# Altium schematic sheet STRWL-S01-V00-Master.SchDoc: STRWL Master
size A3; DrawnBy: Jarrod Fisher; Organization: QUT Motorsport; Address1: O-120, Gardens Point; Address2: 2 George Street; Address3: Brisbane, QLD 4000; Address4: Australia; DocumentNumber: ####; Revision: 00; SheetNumber: 1; SheetTotal: 6; Version: 00; Project: STRWL QEV3; PageSetup: Record=PageOptions|CenterHorizontal=True|CenterVertical=True|PrintScale=0.97|XCorrection=1.00|YCorrection=1.00|PrintKind=0|BorderSize=5000000|LeftOffset=0|BottomOffset=0|Orientation=2|PaperLength=1000|PaperWidth=1000|Scale=100|PaperSource=7|PrintQuality=-4|MediaType=1|DitherType=10|PaperKind=A4|PrintScaleMode=1
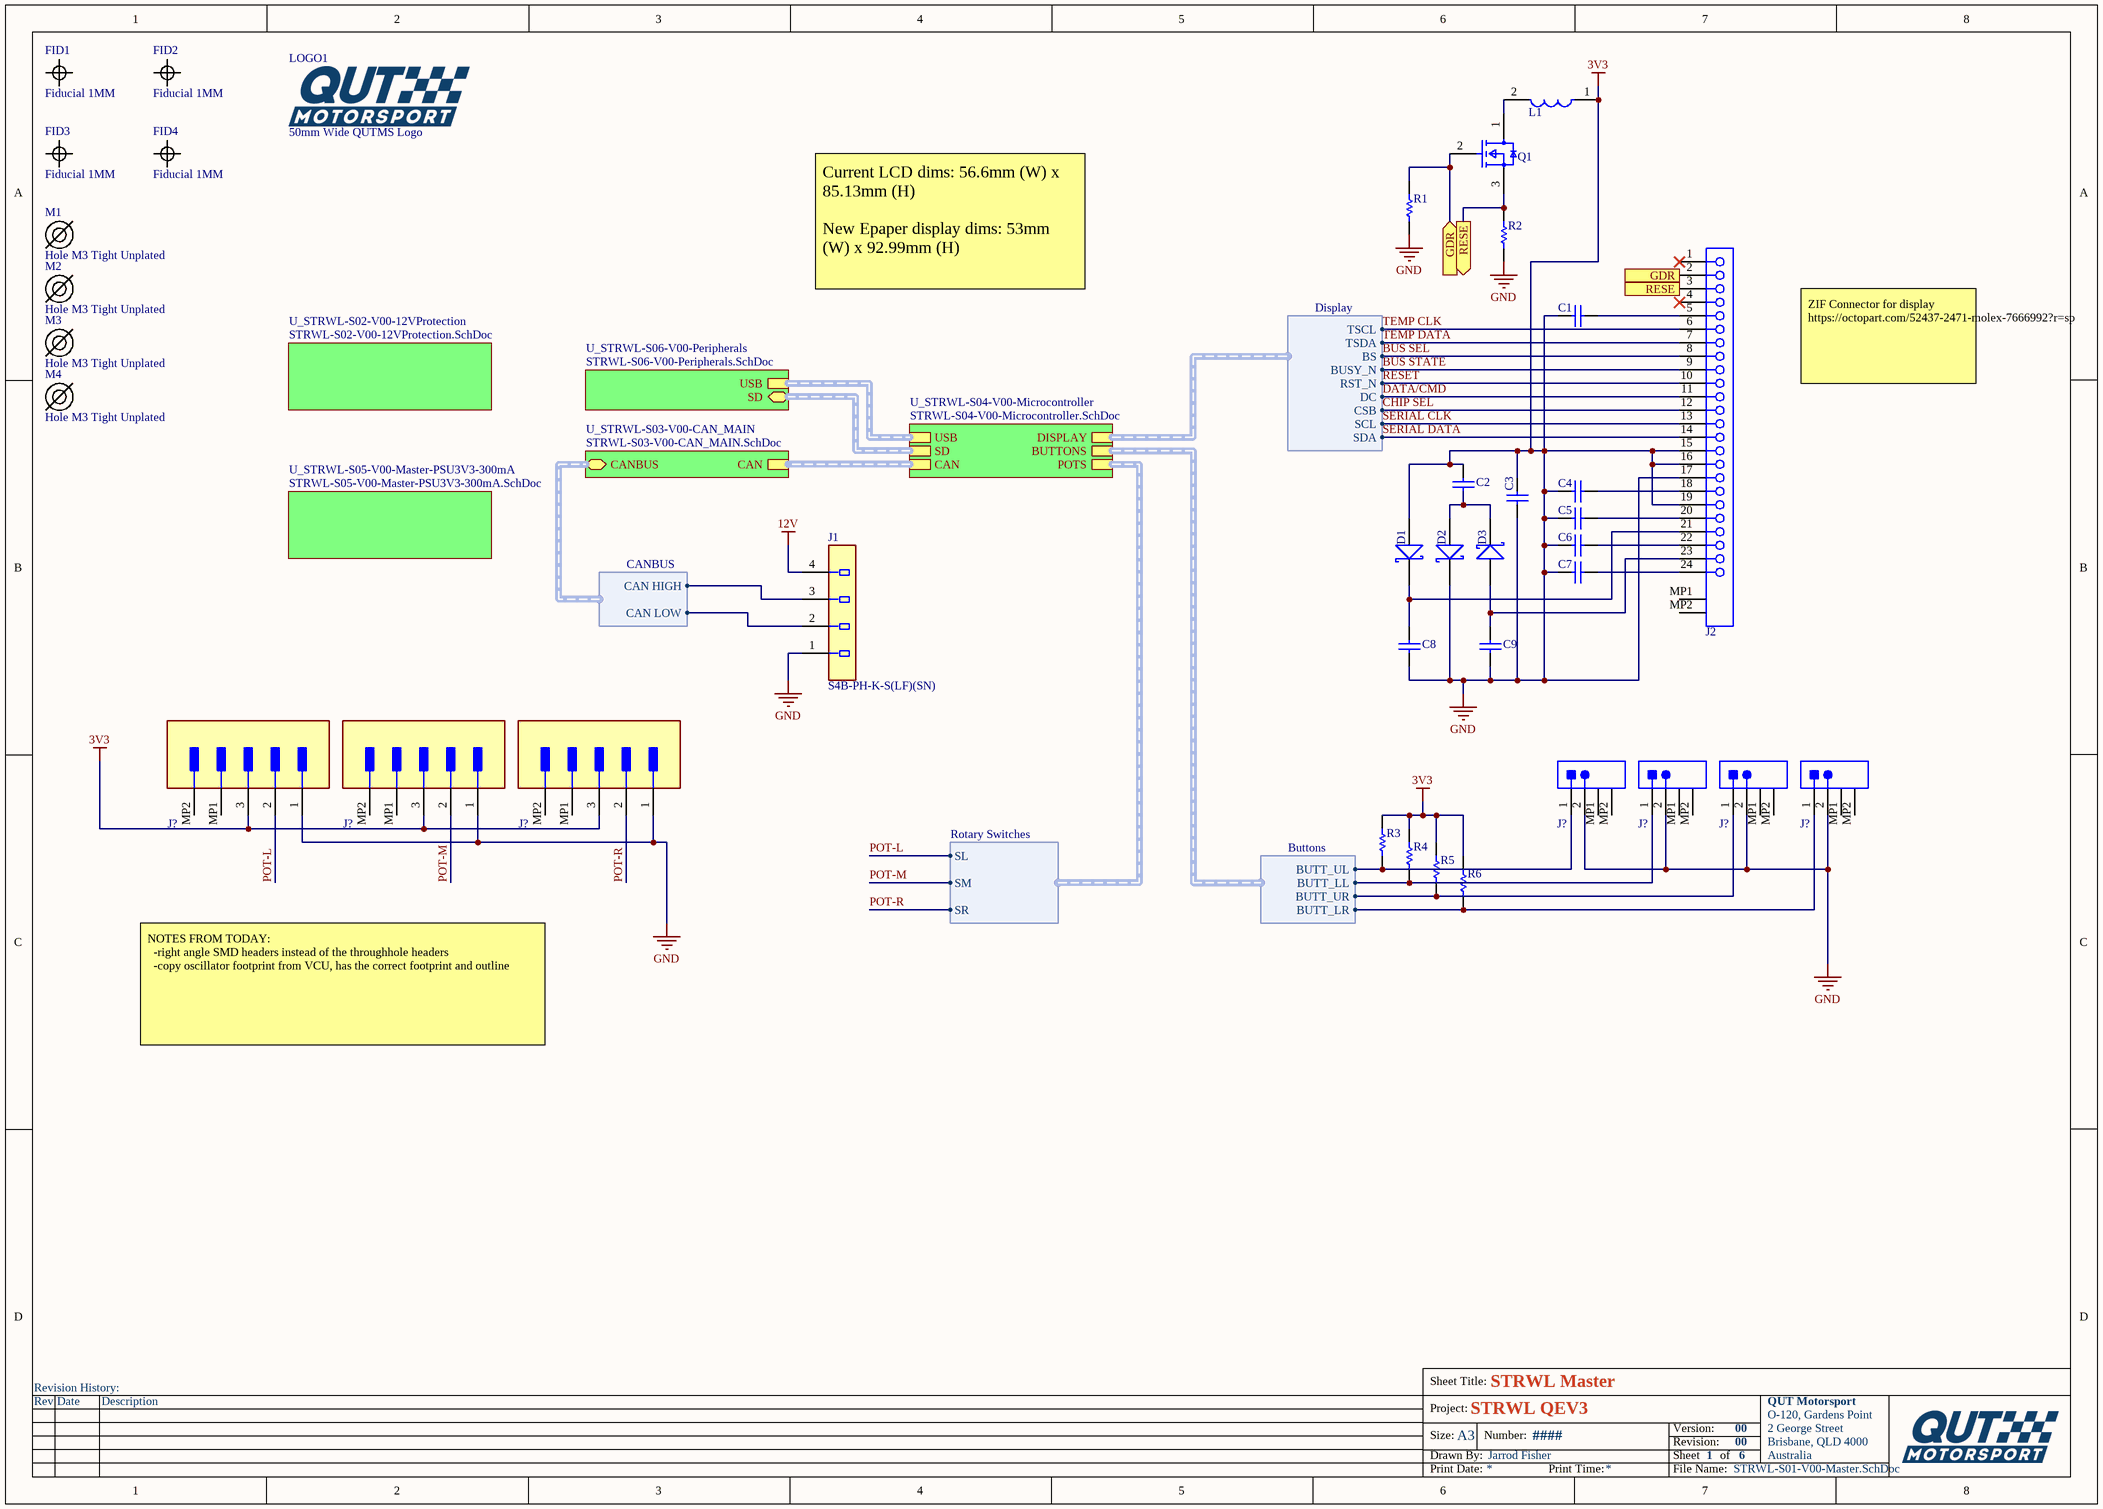
[diagram p0: STRWL-S01-V00-Master.SchDoc]

## Parts
(Parts that share a designator on the sheet are numbered #1, #2 ... from top to bottom, then left to right.)
C1  1uF 25V 5% X7R 0603  [Cap_Ceramic_0603]  (value not drawn)
C2  4u7 50V 5% X7R 0603  [Cap_Ceramic_0603]  (value not drawn)
C3  1uF 25V 5% X7R 0603  [Cap_Ceramic_0603]  (value not drawn)
C4  1uF 25V 5% X7R 0603  [Cap_Ceramic_0603]  (value not drawn)
C5  1uF 25V 5% X7R 0603  [Cap_Ceramic_0603]  (value not drawn)
C6  1uF 25V 5% X7R 0603  [Cap_Ceramic_0603]  (value not drawn)
C7  1uF 25V 5% X7R 0603  [Cap_Ceramic_0603]  (value not drawn)
C8  1uF 25V 5% X7R 0603  [Cap_Ceramic_0603]  (value not drawn)
C9  1uF 25V 5% X7R 0603  [Cap_Ceramic_0603]  (value not drawn)
D1  STPS0530Z  [SOD123]  (value not drawn)
D2  STPS0530Z  [SOD123]  (value not drawn)
D3  STPS0530Z  [SOD123]  (value not drawn)
FID1  Fiducial 1MM  [FIDUCIAL 1MM]  (no BOM)
FID2  Fiducial 1MM  [FIDUCIAL 1MM]  (no BOM)
FID3  Fiducial 1MM  [FIDUCIAL 1MM]  (no BOM)
FID4  Fiducial 1MM  [FIDUCIAL 1MM]  (no BOM)
J1  Part Number: S4B-PH-K-S(LF)(SN)  [JST_S4B-PH-K-S_LF_SN_0]  (hidden comment: JST PH 4 Way Through Hole Header)
J2  52437-2471  [MOLX-52437-2471]  (value not drawn)
J?#1  JST PH 3 Way SMD Header  (value not drawn)
J?#2  JST PH 3 Way SMD Header  (value not drawn)
J?#3  JST PH 3 Way SMD Header  (value not drawn)
J?#4  JST PH 2 Way SMD Header  [JST- S2B-PH-SM4-TB(LF)(SN)-2_V]  (value not drawn)
J?#5  JST PH 2 Way SMD Header  [JST- S2B-PH-SM4-TB(LF)(SN)-2_V]  (value not drawn)
J?#6  JST PH 2 Way SMD Header  [JST- S2B-PH-SM4-TB(LF)(SN)-2_V]  (value not drawn)
J?#7  JST PH 2 Way SMD Header  [JST- S2B-PH-SM4-TB(LF)(SN)-2_V]  (value not drawn)
L1  LQM21FN100M70L  [Murata_LQM21FN_70_MFG]  (value not drawn)
LOGO1  50mm Wide QUTMS Logo  [QUTMS LOGO 10MM]  (no BOM)
M1  Hole M3 Tight Unplated  [M3.2 UNPLATED]
M2  Hole M3 Tight Unplated  [M3.2 UNPLATED]
M3  Hole M3 Tight Unplated  [M3.2 UNPLATED]
M4  Hole M3 Tight Unplated  [M3.2 UNPLATED]
Q1  MOSFET N-CH 30V 4A SOT323  [Diodes_SOT323_0]  (value not drawn)
R1  10k 1% 0603  [Res_ThinFilm_0603]  (value not drawn)
R2  0R47 5% 0603  [Res_ThinFilm_0603]  (value not drawn)
R3  10k 5% 0603  [Res_ThinFilm_0603]  (value not drawn)
R4  10k 5% 0603  [Res_ThinFilm_0603]  (value not drawn)
R5  10k 5% 0603  [Res_ThinFilm_0603]  (value not drawn)
R6  10k 5% 0603  [Res_ThinFilm_0603]  (value not drawn)

## Sub-sheets
U_STRWL-S02-V00-12VProtection = STRWL-S02-V00-12VProtection.SchDoc: no entries
U_STRWL-S03-V00-CAN_MAIN = STRWL-S03-V00-CAN_MAIN.SchDoc: CANBUS (bidir, harness CANBUS), CAN (harness CAN)
U_STRWL-S04-V00-Microcontroller = STRWL-S04-V00-Microcontroller.SchDoc: USB (harness USB), SD (harness SD), CAN (harness CAN), DISPLAY (harness Display), BUTTONS (harness Buttons), POTS (harness Rotary Switches)
U_STRWL-S05-V00-Master-PSU3V3-300mA = STRWL-S05-V00-Master-PSU3V3-300mA.SchDoc: no entries
U_STRWL-S06-V00-Peripherals = STRWL-S06-V00-Peripherals.SchDoc: USB (harness USB), SD (bidir, harness SD)

## Ports
GDR (in), GDR (out), RESE (in), RESE (out)

## Harnesses
CANBUS: CAN HIGH, CAN LOW
Display: CSB, SCL, SDA, TSCL, TSDA, BS, BUSY_N, RST_N, DC
Buttons: BUTT_UL, BUTT_LL, BUTT_UR, BUTT_LR
Rotary Switches: SL, SM, SR

## Nets
3V3: C1.1 C2.2 C3.1 C3.2 C4.1 C5.1 C6.1 C7.1 C8.1 C9.1 D1.A D2.K J1.1 J2.15 J2.16 J2.17 J2.19 J?#1.1 J?#1.3 J?#2.1 J?#2.3 J?#3.1 J?#3.3 J?#4.2 J?#5.2 J?#6.2 J?#7.2 L1.1 R1.2 R2.1 R3.1 R4.1 R5.2 R6.2  [also labelled GND]
12V: J1.4
BUS SEL: J2.8 ; sheet U_STRWL-S04-V00-Microcontroller/DISPLAY.BS
BUS STATE: J2.9 ; sheet U_STRWL-S04-V00-Microcontroller/DISPLAY.BUSY_N
CHIP SEL: J2.12 ; sheet U_STRWL-S04-V00-Microcontroller/DISPLAY.CSB
DATA/CMD: J2.11 ; sheet U_STRWL-S04-V00-Microcontroller/DISPLAY.DC
GDR: J2.2 Q1.2(G) R1.1 ; port GDR
POT-L: J?#1.2 ; sheet U_STRWL-S04-V00-Microcontroller/POTS.SL
POT-M: J?#2.2 ; sheet U_STRWL-S04-V00-Microcontroller/POTS.SM
POT-R: J?#3.2 ; sheet U_STRWL-S04-V00-Microcontroller/POTS.SR
RESE: J2.3 Q1.3(S) R2.2 ; port RESE
RESET: J2.10 ; sheet U_STRWL-S04-V00-Microcontroller/DISPLAY.RST_N
SERIAL CLK: J2.13 ; sheet U_STRWL-S04-V00-Microcontroller/DISPLAY.SCL
SERIAL DATA: J2.14 ; sheet U_STRWL-S04-V00-Microcontroller/DISPLAY.SDA
TEMP CLK: J2.6 ; sheet U_STRWL-S04-V00-Microcontroller/DISPLAY.TSCL
TEMP DATA: J2.7 ; sheet U_STRWL-S04-V00-Microcontroller/DISPLAY.TSDA
NetC1_2: C1.2 J2.5
NetC2_1: C2.1 D2.A D3.K
NetC4_2: C4.2 J2.18
NetC5_2: C5.2 J2.20
NetC6_2: C6.2 J2.22
NetC7_2: C7.2 J2.24
NetC8_2: C8.2 D1.K J2.21
NetC9_2: C9.2 D3.A J2.23
NetJ1_2: J1.2 ; sheet U_STRWL-S03-V00-CAN_MAIN/CANBUS.CAN LOW
NetJ1_3: J1.3 ; sheet U_STRWL-S03-V00-CAN_MAIN/CANBUS.CAN HIGH
NetJ?#4_1: J?#4.1 R3.2 ; sheet U_STRWL-S04-V00-Microcontroller/BUTTONS.BUTT_UL
NetJ?#5_1: J?#5.1 R4.2 ; sheet U_STRWL-S04-V00-Microcontroller/BUTTONS.BUTT_LL
NetJ?#6_1: J?#6.1 R5.1 ; sheet U_STRWL-S04-V00-Microcontroller/BUTTONS.BUTT_UR
NetJ?#7_1: J?#7.1 R6.1 ; sheet U_STRWL-S04-V00-Microcontroller/BUTTONS.BUTT_LR
NetL1_2: L1.2 Q1.1(D)

Not connected (* = marked no-connect by the designer): J2 1* 4* MP1 MP2; J?#1 MP1(MNT_1) MP2(MNT_2); J?#2 MP1(MNT_1) MP2(MNT_2); J?#3 MP1(MNT_1) MP2(MNT_2); J?#4 MP1 MP2; J?#5 MP1 MP2; J?#6 MP1 MP2; J?#7 MP1 MP2

## Buses and harness runs
harness sheet U_STRWL-S03-V00-CAN_MAIN/CAN = sheet U_STRWL-S04-V00-Microcontroller/CAN
harness sheet U_STRWL-S04-V00-Microcontroller/SD = sheet U_STRWL-S06-V00-Peripherals/SD
harness sheet U_STRWL-S04-V00-Microcontroller/USB = sheet U_STRWL-S06-V00-Peripherals/USB

## Notes on the sheet
- Current LCD dims: 56.6mm (W) x 85.13mm (H)
  New Epaper display dims: 53mm (W) x 92.99mm (H)
- ZIF Connector for display
  https://octopart.com/52437-2471-molex-7666992?r=sp
- NOTES FROM TODAY:
  -right angle SMD headers instead of the throughhole headers
  -copy oscillator footprint from VCU, has the correct footprint and outline
- Revision History:
- Sheet Title:
- Rev
- Date
- Description
- Project:
- Size:
- Drawn By:
- A3
- Number:
- Revision:
- Sheet
- Version:
- of
- QUT Motorsport
- O-120, Gardens Point
- 2 George Street
- Brisbane, QLD 4000
- Australia
- Print Date:
- Print Time:
- File Name:

## Library data of the parts
C1 C3-C9 = 1uF 25V 5% X7R 0603: Capacitor, Ceramic, SMD, 1uF, 25V, 5%, X7R, 0603
C2 = 4u7 50V 5% X7R 0603: Capacitor, Ceramic, SMD, 4u7, 50V, 5%, X7R, 0603
D1-D3 = STPS0530Z: Diode, Schottky Barrier Rectifier, 30 V, 0.5 A, STPS0530Z
J2 = 52437-2471: 0.5 mm Pitch Easy-On(TM) Type FPC Connector, Right Angle, ZIF, SMT, Bottom Contact, 24 Circuits, -40 to 85 degC, ELV and RoHS Compliant, Tape and Reel; Manufacturer: Molex; Durability (mating cycles max): 20; Material - Metal: Phosphor Bronze; Polarized to PCB: Yes; Voltage (Max): 50V; Entry Angle: 90degrees Angle; PCB Locator: No; Material - Plating Termination: Gold; Current (Max per Contact): 0.5A; PCB Retention: None; Pitch - Mating Interface: 0.50mm; Circuits (Loaded): 24; Contact Position: Bottom; PartNumber: 52437-2471; ComponentLink1Description: Manufacturer URL; ComponentLink2Description: Datasheet; ComponentLink3URL: http://www.molex.com/pdm_docs/sd/524372471_sd.pdf; ComponentLink3Description: Package Specification; ComponentLink1URL: http://www.molex.com/molex/index.jsp; Packing: Tape and Reel; Number of Rows: 1; ComponentLink2URL: http://www.molex.com/webdocs/datasheets/pdf/en-us/0524372471_FFC_FPC_CONNECTORS.pdf; PackageVersion: Rev. E, 07/2013; RoHS: TRUE; Material - Plating Mating: Gold; Orientation: Right Angle; Stackable: No; Mounting Technology: Surface Mount; PackageReference: 52437-2471; PackageDescription: 24-Lead FPC Connector, Pitch 0.5 mm
J?#4-J?#7 = JST PH 2 Way SMD Header: PartNumber: S2B-PH-SM4-TB(LF)(SN); Current Rating: 3 A; RoHSCompliant: True; Min Operating Temperature: -65degC; Width: 2.34 mm; Pins: 40; ComponentLink1Description: Manufacturer URL; ComponentLink2Description: Datasheet; DatasheetVersion: Dec-12; ComponentLink1URL: http://www.jst.com/home2.html; Contact Plating: Tin; ComponentLink2URL: http://www.jst-mfg.com/product/pdf/eng/ePH.pdf; PackageReference: S2B-PH-SM4-TB(LF)(SN)-2; Mount: Through Hole; Contact Finish: Lead; Length: 101.19 mm; Radiation Hardening: No; Lead Pitch: 0.1 inch; Max Operating Temperature: 105degC; Colour: Black; Package Quantity: 100; Height: 8.13 mm; Packaging: Bulk; PackageDescription: Male Header, Pitch 2 mm, 1 x 2 Position, Height 5.5 mm; Contact Material: Bronze
L1 = LQM21FN100M70L: FIXED IND 10UH
LOGO1 = QUTMS Logo 50mm
M1-M4 = Hole M3 Tight Unplated: M3.2 Hole, No Plating
Q1 = DMN3065LW-13: N-Channel 30V 4A (Ta) 770mW (Ta) Surface Mount SOT-323
R1 = 10k 1% 0603: Resistor, SMD, 10k, 0.1W, 1%, 0603
R2 = 0R47 5% 0603_1: Resistor, SMD, 0R, 0.1W, 5%, 0603
R3-R6 = 10k 5% 0603: Resistor, SMD, 10k, 0.1W, 5%, 0603
J1 = JST PH 4 Way Through Hole Header: helpURL: https://upverter.com/upn/revision/a04d3038e6c69606/; ComponentLink2Description: Datasheet; Temperature: -25°C to +85°C; Package: HDR4; Supplier 2: Mouser; Price: 0.141609370397; Supplier 1: Digi-Key; ComponentLink1URL: https://upverter.com/upn/revision/a04d3038e6c69606/; Supplier Part Number 1: 455-1721-ND; Manufacturer: JST; ComponentLink1Description: Upverter; ComponentLink2URL: http://www.jst-mfg.com/product/pdf/eng/ePH.pdf; RoHS: TRUE; Temperature Range High: +85°C; Digikey Description: CONN HEADER PH SIDE 4POS 2MM; Digikey Part Number: 455-1721-ND; Temperature Range Low: -25°C; Lead Free: yes